# EAGLE board STGHW00054_A2 (EAGLE 9.6.2), part 1 of 2
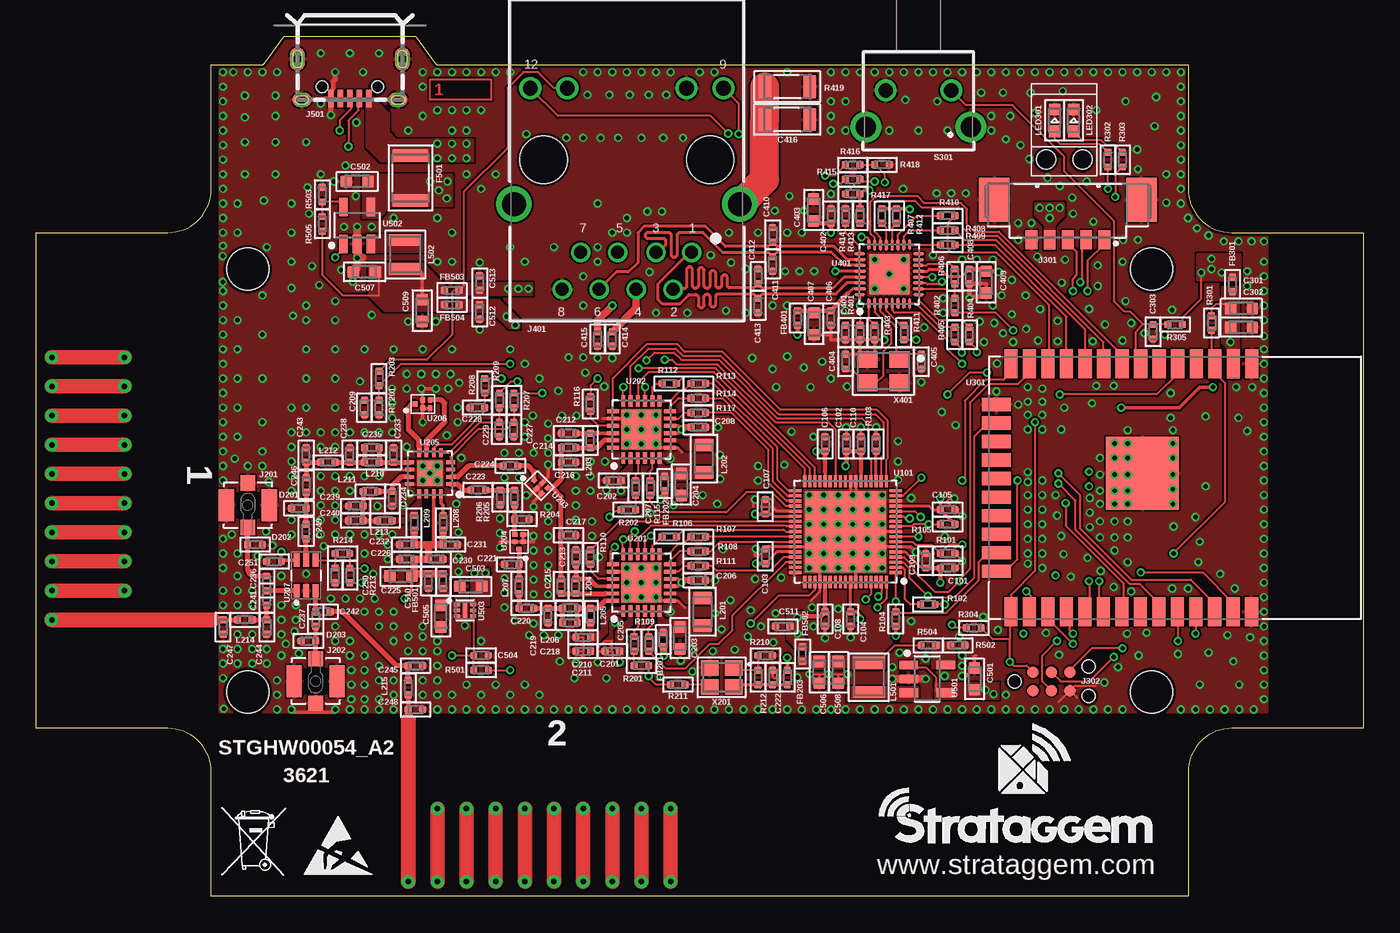
[diagram p6: board, top side]
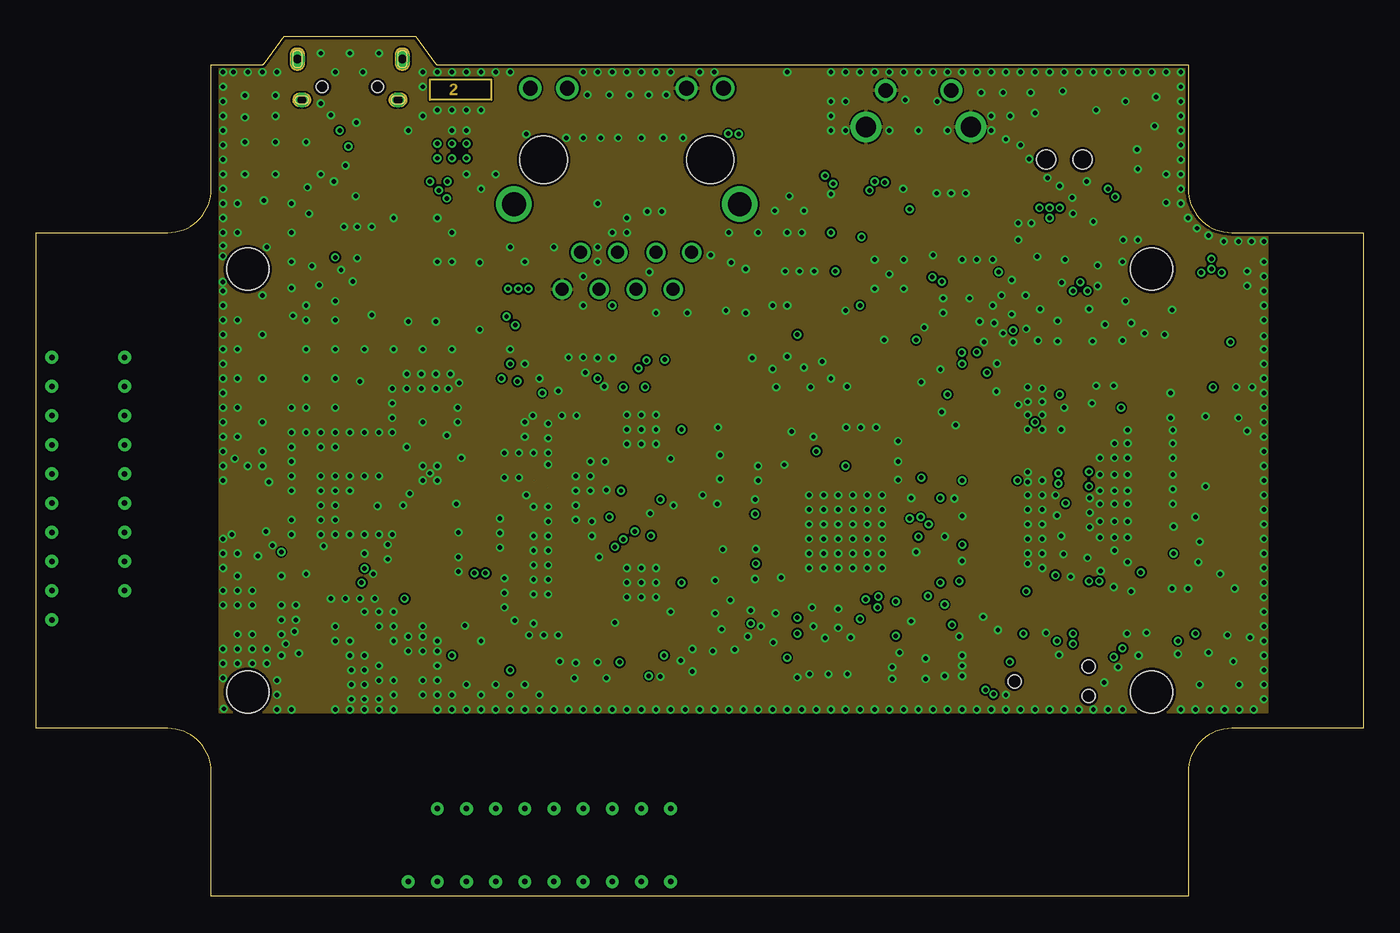
[diagram p7: board, inner layer Route2]
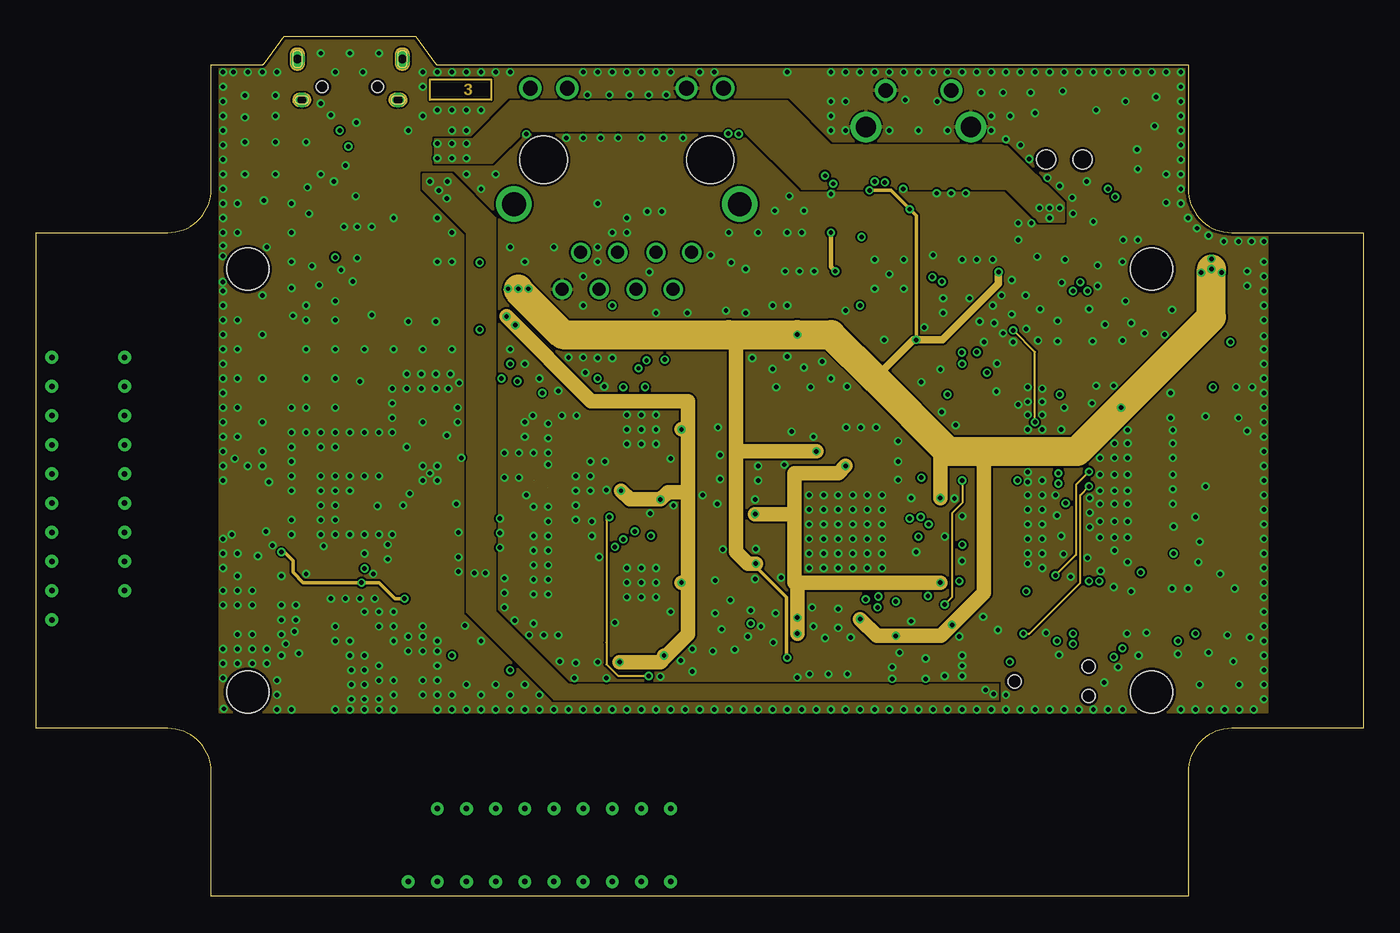
[diagram p8: board, inner layer Route15]
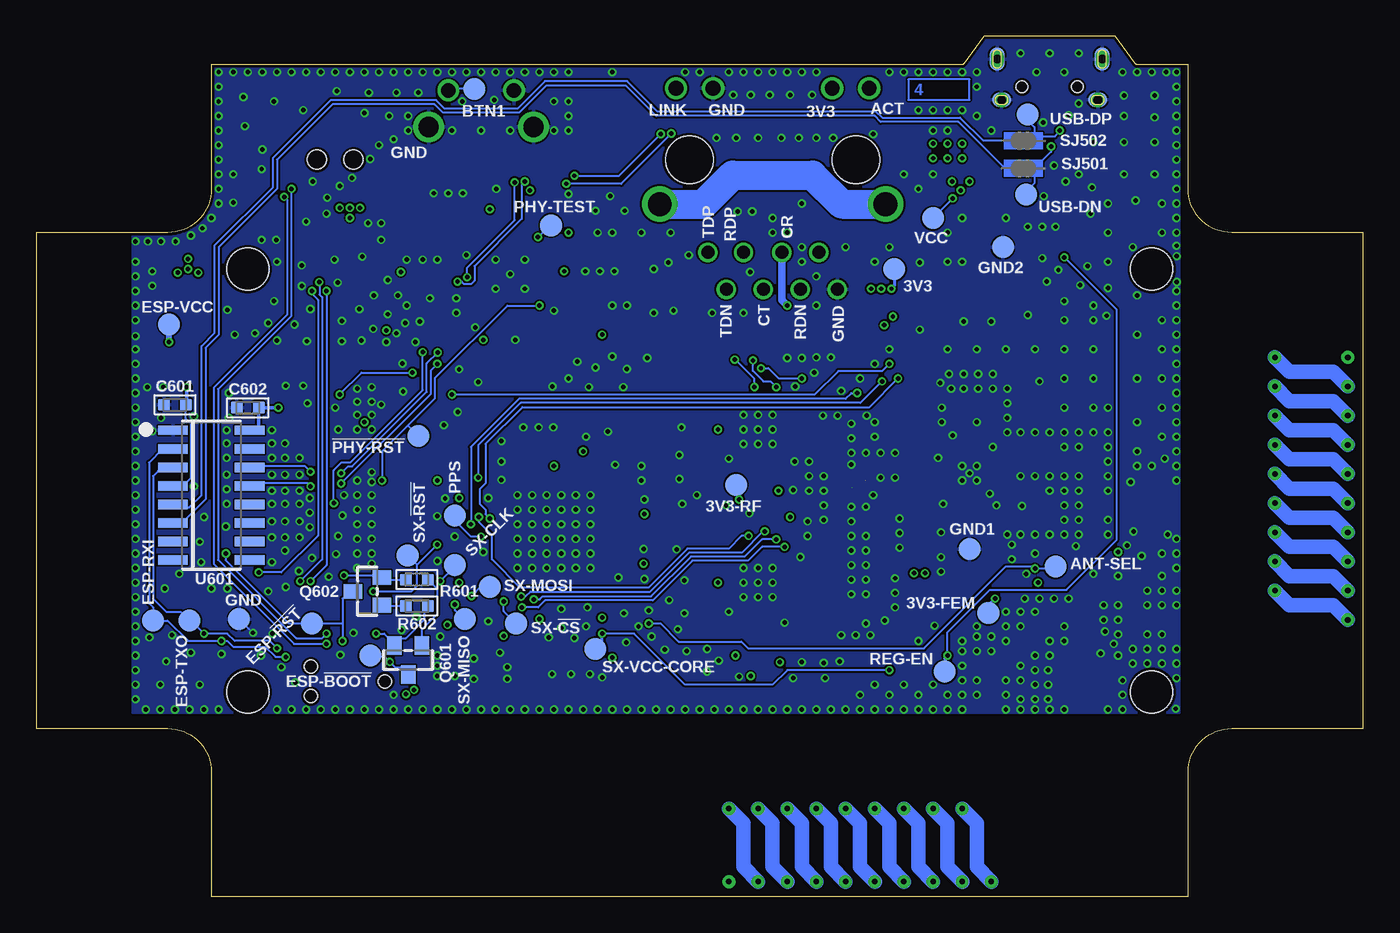
[diagram p9: board, bottom side, seen from below]

Size 91 x 58.95 mm. Coordinates in mm from the lower left corner, seen from the top.
Outline: 0,45.5 9,45.5 arc90 12,48.5 12,57 15.45,57 arc53 15.61,57.08 17,58.95 26,58.95 27.39,57.08 arc53 27.55,57 79,57 79,48.5 arc90 82,45.5 91,45.5 91,11.5 82,11.5 arc90 79,8.5 79,0 12,0 12,8.5 arc90 9,11.5 0,11.5 0,45.5
Copper layers (1+2*15+16): Top 0.035mm / dielectric 0.2mm / Route2 0.0175mm / dielectric 1.065mm / Route15 0.0175mm / dielectric 0.2mm / Bottom 0.035mm
Design rules "JLCPCB_4L *": minimum track width 5mil, minimum drill 12mil, track to track 5mil, track to pad 5mil, pad to pad 5mil, via to via 5mil, smd to smd 0mil, copper to edge 0.2mm, drill to drill 12mil, minimum pad ring 5mil, minimum via ring 5mil, stop-mask expansion 2mil, vias tented up to drill 12mil, thermal gap 5mil
Net classes: 0 default: width 0.152 mm; 1 LORA_RF: width 0.349 mm, clearance 0.203 mm to class 0, clearance 0.203 mm; 2 ETH_DP: width 0.203 mm, clearance 0.3 mm to class 0, clearance 0.203 mm; 3 CHASSIS_GND: clearance 0.5 mm to class 0, clearance 0.5 mm to class 1, clearance 0.5 mm to class 2, clearance 0.5 mm
tKeepout: area 11.8,40.2 to 17.2,45.8; area 11.8,11.2 to 17.2,16.8; area 73.8,11.2 to 79.2,16.8; area 73.8,40.2 to 79.2,45.8

## Footprints (pad centres in the part's own frame; a part is rotated, then mirrored left to right if it is on the bottom)
TESTPOINT-1.5MM = smd 1.5 x 1.5: 1 0,0
DN038 = smd 0.4 x 0.4: FEED 0,-0.2 | drill 0.38 pad 0.89: P$1 0,11.5; P$2 2,6.5; P$3 2,11.5; P$4 4,6.5; P$5 4,11.5; P$6 6,6.5; P$7 6,11.5; P$8 8,6.5; P$9 8,11.5; P$10 10,6.5; P$11 10,11.5; P$12 12,6.5; P$13 12,11.5; P$14 14,6.5; P$15 14,11.5; P$16 16,6.5; P$17 16,11.5; P$18 18,6.5; P$19 18,11.5
DN038_MIRROR = smd 0.4 x 0.4: FEED 9,-0.2 | drill 0.38 pad 0.89: P$1 9,11.5; P$2 7,6.5; P$3 7,11.5; P$4 5,6.5; P$5 5,11.5; P$6 3,6.5; P$7 3,11.5; P$8 1,6.5; P$9 1,11.5; P$10 -1,6.5; P$11 -1,11.5; P$12 -3,6.5; P$13 -3,11.5; P$14 -5,6.5; P$15 -5,11.5; P$16 -7,6.5; P$17 -7,11.5; P$18 -9,6.5; P$19 -9,11.5
C0402 = smd 0.5 x 0.5: 1 -0.5,0; 2 0.5,0
C0603 = smd 0.8 x 0.8: 1 -0.75,0; 2 0.75,0
C1206-H0.8 = smd 0.9 x 1.6: 1 -1.55,0; 2 1.55,0
TVS0402 = smd 0.5 x 0.5: 1 -0.5,0; 2 0.5,0
1210 = smd 0.9 x 2.5: 1 -1.55,0; 2 1.55,0
FB0402 = smd 0.5 x 0.5: 1 -0.5,0; 2 0.5,0
U.FL_AMPHENOL_RF_A-1JB = smd 2.2 x 1.05: 1@GND 0,-1.475; GND 0,1.475 | smd 1.05 x 1: 2@GND -1.525,0; ANT 1.525,0
533980567-PICOBLADE-5P-SMT-VER = smd 0.8 x 1.3: 1 2.5,-1.25; 2 1.25,-1.25; 3 0,-1.25; 4 -1.25,-1.25; 5 -2.5,-1.25 | smd 2.1 x 3: M1 5.05,1.5; M2 -5.05,1.5
TC2030-MCP-NL = smd 0.787 x 0.787: 1 1.27,-0.635; 2 1.27,0.635; 3 2.54,-0.635; 4 2.54,0.635; 5 3.81,-0.635; 6 3.81,0.635 | hole 0.889: 0,0; 5.08,-1.016; 5.08,1.016
RJ45_8P_TH_2LED = drill 0.89: 1 4.45,-6.35; 2 3.18,-8.89; 3 2,-6.35; 4 0.64,-8.89; 5 -0.63,-6.35; 6 -1.9,-8.89; 7 -3.17,-6.35; 8 -4.44,-8.89 | drill 1.02: 9 6.625,4.9; 10 4.085,4.9; 11 -4.085,4.9; 12 -6.625,4.9 | drill 1.63: Z1 -7.745,-3.05; Z2 7.745,-3.05 | hole 3.25: -5.715,0; 5.715,0
USB_MICRO_3 = smd 0.4 x 1.2: 1 -1.3,2.7; 2 -0.65,2.7; 3 0,2.7; 4 0.65,2.7; 5 1.3,2.7 | drill 0.6 pad 1: M1 -3.3,2.8; M2 3.3,2.8 | drill 0.6 pad 0.8 long: M3 -3.6,0; M4 3.6,0 | smd 1.3 x 1 bottom: MB1 -3.3,2.8; MB2 3.3,2.8 | smd 1 x 1.6 bottom: MB3 -3.6,0; MB4 3.6,0 | smd 1.3 x 1: MT1 -3.3,2.8; MT2 3.3,2.8 | smd 1 x 1.6: MT3 -3.6,0; MT4 3.6,0 | hole 0.8: -1.9,1.9; 1.9,1.9
L0805 = smd 0.9 x 1.3: 1 -0.95,0; 2 0.95,0
L0402 = smd 0.5 x 0.5: 1 -0.5,0; 2 0.5,0
1008 = smd 0.8 x 2.2: 1 -1,0; 2 1,0
LED0603 = smd 0.8 x 0.8: A -0.75,0; K 0.75,0
SLP3-150-250-F = hole 1.3: -1.25,0; 1.25,0
SOT23-WIDE = smd 1 x 1.27: 1 -0.95,-1; 2 0.95,-1; 3 0,1
R0402 = smd 0.5 x 0.5: 1 -0.5,0; 2 0.5,0
R1206 = smd 0.9 x 1.6: 1 -1.55,0; 2 1.55,0
R0603 = smd 0.8 x 0.8: 1 -0.75,0; 2 0.75,0
6MM-TH-RA = drill 1.4: 1 -3.6,1.25; 4 3.6,1.25 | drill 1: 2 -2.25,-1.25; 3 2.25,-1.25
JUMPER2-0603_NC = smd 0.305 x 0.152: 1 0,0.76; 2 0,-0.76
QFN35P700X700X80-69T556 = smd 0.85 x 0.22: 1 -3.45,2.8; 2 -3.451,2.45; 3 -3.451,2.1; 4 -3.451,1.75; 5 -3.451,1.4; 6 -3.451,1.05; 7 -3.451,0.7; 8 -3.451,0.35; 9 -3.451,0; 10 -3.451,-0.35; 11 -3.451,-0.7; 12 -3.451,-1.05; 13 -3.451,-1.4; 14 -3.451,-1.75; 15 -3.451,-2.1; 16 -3.451,-2.45; 17 -3.451,-2.8; 35 3.451,-2.8; 36 3.451,-2.45; 37 3.451,-2.1; 38 3.451,-1.75; 39 3.451,-1.4; 40 3.451,-1.05; 41 3.451,-0.7; 42 3.451,-0.35; 43 3.451,0; 44 3.451,0.35; 45 3.451,0.7; 46 3.451,1.05; 47 3.451,1.4; 48 3.451,1.75; 49 3.451,2.1; 50 3.451,2.45; 51 3.451,2.8 | smd 0.22 x 0.85: 18 -2.8,-3.451; 19 -2.45,-3.451; 20 -2.1,-3.451; 21 -1.75,-3.451; 22 -1.4,-3.451; 23 -1.05,-3.451; 24 -0.7,-3.451; 25 -0.35,-3.451; 26 0,-3.451; 27 0.35,-3.451; 28 0.7,-3.451; 29 1.05,-3.451; 30 1.4,-3.451; 31 1.75,-3.451; 32 2.1,-3.451; 33 2.45,-3.451; 34 2.8,-3.451; 52 2.8,3.451; 53 2.45,3.451; 54 2.1,3.451; 55 1.75,3.451; 56 1.4,3.451; 57 1.05,3.451; 58 0.7,3.451; 59 0.35,3.451; 60 0,3.451; 61 -0.35,3.451; 62 -0.7,3.451; 63 -1.05,3.451; 64 -1.4,3.451; 65 -1.75,3.451; 66 -2.1,3.451; 67 -2.45,3.451; 68 -2.8,3.451 | smd 5.56 x 5.56: 69 0,0
QFN50P400X400X100-25T270 = smd 0.811 x 0.264: 1 -1.951,1.25; 2 -1.951,0.75; 3 -1.951,0.25; 4 -1.951,-0.25; 5 -1.951,-0.75; 6 -1.951,-1.25; 13 1.951,-1.25; 14 1.951,-0.75; 15 1.951,-0.25; 16 1.951,0.25; 17 1.951,0.75; 18 1.951,1.25 | smd 0.264 x 0.811: 7 -1.25,-1.951; 8 -0.75,-1.951; 9 -0.25,-1.951; 10 0.25,-1.951; 11 0.75,-1.951; 12 1.25,-1.951; 19 1.25,1.951; 20 0.75,1.951; 21 0.25,1.951; 22 -0.25,1.951; 23 -0.75,1.951; 24 -1.25,1.951 | smd 2.7 x 2.7: 25 0,0
B4377 = smd 0.3 x 0.375: 1 -0.5,0; 2 0,-0.287; 3 0.5,-0.287; 4 0.5,0.287; 5 0,0.287
QFN50P300X300X80-17T170 = smd 0.6 x 0.25: 1 -1.401,0.75; 2 -1.401,0.25; 3 -1.401,-0.25; 4 -1.401,-0.75; 9 1.401,-0.75; 10 1.401,-0.25; 11 1.401,0.25; 12 1.401,0.75 | smd 0.25 x 0.6: 5 -0.75,-1.401; 6 -0.25,-1.401; 7 0.25,-1.401; 8 0.75,-1.401; 13 0.75,1.401; 14 0.25,1.401; 15 -0.25,1.401; 16 -0.75,1.401 | smd 1.7 x 1.7: 17 0,0
SC70-6 = smd 0.4 x 0.9: 1 -0.65,-1.05; 2 0,-1.05; 3 0.65,-1.05; 4 0.65,1.05; 5 0,1.05; 6 -0.65,1.05
ESP32-WROOM-32D = smd 2 x 0.9: 1 -8.5,5.26; 2 -8.5,3.99; 3 -8.5,2.72; 4 -8.5,1.45; 5 -8.5,0.18; 6 -8.5,-1.09; 7 -8.5,-2.36; 8 -8.5,-3.63; 9 -8.5,-4.9; 10 -8.5,-6.17; 11 -8.5,-7.44; 12 -8.5,-8.71; 13 -8.5,-9.98; 14 -8.5,-11.25; 25 8.5,-11.26; 26 8.5,-9.99; 27 8.5,-8.72; 28 8.5,-7.45; 29 8.5,-6.18; 30 8.5,-4.91; 31 8.5,-3.64; 32 8.5,-2.37; 33 8.5,-1.1; 34 8.5,0.17; 35 8.5,1.44; 36 8.5,2.71; 37 8.5,3.98; 38 8.5,5.25 | smd 0.9 x 2: 15 -5.715,-12.25; 16 -4.445,-12.25; 17 -3.175,-12.25; 18 -1.905,-12.25; 19 -0.635,-12.25; 20 0.635,-12.25; 21 1.905,-12.25; 22 3.175,-12.25; 23 4.445,-12.25; 24 5.715,-12.25 | smd 5 x 5: PAD -1,-2.24
QFN40P400X400X90-33T275N = smd 0.75 x 0.2: 1 -2.025,1.4; 8 -2.025,-1.4; 17 2.025,-1.4; 24 2.025,1.4 | smd 0.8 x 0.2: 2 -2,1; 3 -2,0.6; 4 -2,0.2; 5 -2,-0.2; 6 -2,-0.6; 7 -2,-1; 18 2,-1; 19 2,-0.6; 20 2,-0.2; 21 2,0.2; 22 2,0.6; 23 2,1 | smd 0.2 x 0.75: 9 -1.4,-2.025; 16 1.4,-2.025; 25 1.4,2.025; 32 -1.4,2.025 | smd 0.2 x 0.8: 10 -1,-2; 11 -0.6,-2; 12 -0.2,-2; 13 0.2,-2; 14 0.6,-2; 15 1,-2; 26 1,2; 27 0.6,2; 28 0.2,2; 29 -0.2,2; 30 -0.6,2; 31 -1,2 | smd 2.75 x 2.75: 33 0,0
SOT95P280X120-5 = smd 1.273 x 0.592: 1 -1.269,0.95; 2 -1.269,0; 3 -1.269,-0.95; 4 1.269,-0.95; 5 1.269,0.95
SON40P120X120X80-7T40X108N = smd 0.4 x 0.24: 1 -0.55,0.4; 2 -0.55,0; 3 -0.55,-0.4; 4 0.55,-0.4; 5 0.55,0; 6 0.55,0.4 | smd 0.3 x 1: 7 0,0
SOIC127P600X175-16 = smd 2.046 x 0.645: 1 -2.635,4.445; 2 -2.635,3.175; 3 -2.635,1.905; 4 -2.635,0.635; 5 -2.635,-0.635; 6 -2.635,-1.905; 7 -2.635,-3.175; 8 -2.635,-4.445; 9 2.635,-4.445; 10 2.635,-3.175; 11 2.635,-1.905; 12 2.635,-0.635; 13 2.635,0.635; 14 2.635,1.905; 15 2.635,3.175; 16 2.635,4.445
PFF10-4-7(OUTLINE) = hole 2.9: -31,14.5; -31,-14.5; 31,-14.5; 31,14.5
OSCCC250X200X90N = smd 1.2 x 1.05: 1 -0.825,-0.65; 2 0.825,-0.65; 3 0.825,0.65; 4 -0.825,0.65
OSCCC350X250X80 = smd 1.4 x 1.15: 1 -1.1,-0.8; 2 1.1,-0.8; 3 1.1,0.8; 4 -1.1,0.8

## Placement (x,y rotation side)
3V3  TESPOINT-SMD1.5MM  [TESTPOINT-1.5MM]  32.15,43 0 bottom
3V3-FEM  TESPOINT-SMD1.5MM  [TESTPOINT-1.5MM]  25.7,19.4 0 bottom
3V3-RF  TESPOINT-SMD1.5MM  [TESTPOINT-1.5MM]  43,28.2 0 bottom
!PHY-RST!  TESPOINT-SMD1.5MM  [TESTPOINT-1.5MM]  64.8,31.56 0 bottom
ANT201  MLA-DN038  [DN038]  12.55,18.95 90 top
ANT202  MLA-DN038-MIRROR  [DN038_MIRROR]  34.5,12.5 180 top
ANT-SEL  TESPOINT-SMD1.5MM  [TESTPOINT-1.5MM]  21.1,22.6 0 bottom
BTN1  TESPOINT-SMD1.5MM  [TESTPOINT-1.5MM]  60.95,55.35 0 bottom
C101  1uF  [C0402]  62.5,22.5 180 top
C102  1uF  [C0402]  55.55,31 270 top
C103  100nF  [C0402]  50,23.3 270 top
C104  100nF  [C0402]  55.85,19 90 top
C105  100nF  [C0402]  62.5,26.5 180 top
C106  100nF  [C0402]  54.1,31 270 top
C107  100nF  [C0402]  50,26.7 270 top
C108  100nF  [C0402]  54.1,19 90 top
C109  100nF  [C0402]  61,23 270 top
C110  100nF  [C0402]  56.55,31 270 top
C201  1uF  [C0402]  39.5,16.8 0 top
C202  1uF  [C0402]  39.6,28.5 0 top
C203  470nF  [C0603]  44.15,17.7 90 top
C204  470nF  [C0603]  44.25,28.23 90 top
C205  10pF  [C0402]  41,17.3 270 top
C206  100nF  [C0402]  45.4,21.65 180 top
C207  10pF  [C0402]  41.1,28 270 top
C208  100nF  [C0402]  45.4,32.15 180 top
C209  100nF  [C0402]  22.5,33.5 90 top
C210  47pF  [C0402]  37.5,17.75 0 top
C211  47nF  [C0402]  37.5,16.8 0 top
C212  3.6pF  [C0402]  36.5,31.75 0 top
C213  3.6pF  [C0402]  37,23.25 270 top
C214  3.6pF  [C0402]  36.5,30.75 180 top
C215  3.6pF  [C0402]  36,21.25 90 top
C216  DNP  [C0402]  36.5,29.75 180 top
C217  DNP  [C0402]  36.5,24.75 180 top
C218  3.3pF  [C0402]  36.6,18.75 0 top
C219  5.6pF  [C0402]  35.1,19.25 90 top
C220  39pF  [C0402]  33.6,19.75 0 top
C221  2.2pF  [C0402]  32.6,22.75 0 top
C222  100nF  [C0402]  50.5,15 270 top
C223  56pF  [C0402]  30.3,27.85 180 top
C224  56pF  [C0402]  32.5,29.5 180 top
C225  10uF  [C0603]  25,21.95 0 top
C226  10nF  [C0402]  25.4,23.1 180 top
C227  56pF  [C0402]  32.75,32 90 top
C228  56pF  [C0402]  30.25,33.5 0 top
C229  56pF  [C0402]  31.75,32 90 top
C230  1nF  [C0402]  27.4,23.1 180 top
C231  100pF  [C0402]  28.4,24.1 0 top
C232  100pF  [C0402]  25.4,24.1 180 top
C233  3.3pF  [C0402]  24.5,30.25 90 top
C234  1.3pF  [C0402]  24.4,27.25 270 top
C235  1.5pF  [C0402]  23,30.75 180 top
C236  56pF  [C0402]  15.8,21.45 90 top
C237  56pF  [C0402]  19.15,19 270 top
C238  3.3pF  [C0402]  21.5,30.25 90 top
C239  10pF  [C0402]  21.9,26.75 180 top
C240  DNP  [C0402]  21.9,25.75 180 top
C241  56pF  [C0402]  15.8,20.45 90 top
C242  56pF  [C0402]  19.65,19.5 180 top
C243  2.7pF  [C0402]  18.5,30.25 90 top
C244  6.2pF  [C0402]  15.8,18.45 270 top
C245  DNP  [C0402]  26,15.8 0 top
C246  56pF  [C0402]  18.5,28.2 270 top
C247  DNP  [C0402]  12.8,18.45 270 top
C248  4.1nH  [C0402]  26,12.8 0 top
C249  56pF  [C0402]  18.5,25 90 top
C250  56pF  [C0402]  20.5,22 90 top
C251  100nF  [C0402]  16.3,22.95 0 top
C301  10uF  [C0603]  82.65,40.3 180 top
C302  10uF  [C0603]  82.65,39 180 top
C303  100nF  [C0402]  76.6,38.7 90 top
C401  100nF  [C0402]  55.5,38.65 90 top
C402  100nF  [C0402]  54.5,46.65 270 top
C403  10uF  [C0603]  53.3,47.05 270 top
C404  10pF  [C0402]  55.5,36.65 270 top
C405  10pF  [C0402]  60.7,36.65 90 top
C406  100nF  [C0402]  54.5,39.65 90 top
C407  10uF  [C0603]  53.35,39.25 90 top
C408  100nF  [C0402]  64,42.5 90 top
C409  10uF  [C0603]  65.15,42.1 90 top
C410  10pF  [C0402]  50.5,45.35 270 top
C411  10pF  [C0402]  50.5,43.35 90 top
C412  10pF  [C0402]  49.5,42.5 270 top
C413  10pF  [C0402]  49.5,40.5 90 top
C414  100nF  [C0402]  39.5,38.2 90 top
C415  100nF  [C0402]  38.5,38.2 90 top
C416  1nF 1kV  [C1206-H0.8]  51.5,53.25 180 top
C501  10uF  [C0603]  64.34,14.9 270 top
C502  10uF  [C0603]  22,49 180 top
C503  10uF  [C0603]  29.8,21.25 0 top
C504  100nF  [C0402]  30.5,16.5 180 top
C505  10uF  [C0603]  27.75,19.2 90 top
C506  10uF  [C0603]  53.7,15.35 90 top
C507  10uF  [C0603]  22.5,42.8 180 top
C508  10uF  [C0603]  55,15.35 270 top
C509  10uF  [C0603]  26.45,40.15 270 top
C510  100nF  [C0402]  26.9,21.6 90 top
C511  100nF  [C0402]  51.2,18.5 0 top
C512  100nF  [C0402]  30.4,40.05 90 top
C513  100nF  [C0402]  30.4,42.05 270 top
C601  1uF  [C0603]  81.5,33.7 0 bottom
C602  100nF  [C0603]  76.5,33.5 0 bottom
D201  8231714A  [TVS0402]  18,26.6 0 top
D202  8231714A  [TVS0402]  15,24.1 180 top
D203  8231714A  [TVS0402]  18.65,17.5 0 top
ESP-!BOOT!  TESPOINT-SMD1.5MM  [TESTPOINT-1.5MM]  68.1,16.5 0 bottom
ESP-!RST!  TESPOINT-SMD1.5MM  [TESTPOINT-1.5MM]  72.1,18.7 0 bottom
ESP-RXI  TESPOINT-SMD1.5MM  [TESTPOINT-1.5MM]  83,18.9 0 bottom
ESP-TXO  TESPOINT-SMD1.5MM  [TESTPOINT-1.5MM]  80.5,18.9 0 bottom
ESP-VCC  TESPOINT-SMD1.5MM  [TESTPOINT-1.5MM]  81.9,39.2 0 bottom
F501  1.5/3A 8V  [1210]  25.65,49.25 270 top
FB201  DNP  [FB0402]  43,17.6 90 top
FB202  DNP  [FB0402]  43.1,28.3 90 top
FB203  >1A 60R@100MHz DCR<0.1R  [FB0402]  51.5,15 270 top
FB301  >1A 60R@100MHz DCR<0.1R  [FB0402]  82.05,41.95 90 top
FB401  >1A 60R@100MHz DCR<0.1R  [FB0402]  52.2,39.65 270 top
FB501  >1A 60R@100MHz DCR<0.1R  [FB0402]  27.9,21.6 90 top
FB502  >1A 60R@100MHz DCR<0.1R  [FB0402]  52.55,16.6 90 top
FB503  >1A 60R@100MHz DCR<0.1R  [FB0402]  28.5,41.55 0 top
FB504  >1A 60R@100MHz DCR<0.1R  [FB0402]  28.5,40.55 0 top
GND  TESPOINT-SMD1.5MM  [TESTPOINT-1.5MM]  77.1,19 0 bottom
GND1  TESPOINT-SMD1.5MM  [TESTPOINT-1.5MM]  27,23.8 0 bottom
GND2  TESPOINT-SMD1.5MM  [TESTPOINT-1.5MM]  24.7,44.5 0 bottom
J201  DNP  [U.FL_AMPHENOL_RF_A-1JB]  14.5,26.8 270 top
J202  DNP  [U.FL_AMPHENOL_RF_A-1JB]  19.15,14.75 90 top
J301  DNP  [533980567-PICOBLADE-5P-SMT-VER]  70.75,46.25 0 top
J302  TC2030-ESP-NL  [TC2030-MCP-NL]  67.09,14.73 0 top
J401  HR913550A  [RJ45_8P_TH_2LED]  40.5,50.5 0 top
J501  U254-051N-4BH806  [USB_MICRO_3]  21.5,57.4 180 top
L201  15uH >100mA <2R  [L0805]  45.7,19.5 90 top
L202  15uH >100mA <2R  [L0805]  45.8,30 90 top
L203  12nH  [L0402]  38,31.25 90 top
L204  12nH  [L0402]  37,21.25 90 top
L205  47nH  [L0402]  38,19.25 270 top
L206  2.5nH  [L0402]  36.6,19.75 180 top
L207  4.7nH  [L0402]  33.1,21.25 90 top
L208  1.2nH  [L0402]  27.9,25.6 270 top
L209  6.8nH  [L0402]  25.9,25.6 270 top
L210  5.6nH  [L0402]  23,29.75 180 top
L211  7.5nH  [L0402]  22.9,27.75 180 top
L212  5.6nH  [L0402]  20,29.75 180 top
L213  3.0nH  [L0402]  23.9,25.75 0 top
L214  6.2nH  [L0402]  14.3,18.95 180 top
L215  4.0pF  [L0402]  25.5,14.3 270 top
L501  2.2uH  [1008]  57.1,15 90 top
L502  2.2uH  [1008]  25.3,44 270 top
LED301  GREEN  [LED0603]  69.85,53.2 90 top
LED302  RED  [LED0603]  71.15,53.2 90 top
LOGO1  LOGO_STRATAGGEM_SILK_5  [STG_LOGO_1L_SILK_5]  66,7 0 top
LOGO601  ESD_LOGO-SILK-TOP-5  [ESD_TOP_5MM]  20.7,3.5 0 top
LOGO602  DEEE_LOGO-SILK-TOP-5  [DEEE_MUELLTONNE_TOP_5MM]  14.9,3.8 0 top
LP1  SLP3-150-250-F  [SLP3-150-250-F]  70.5,50.5 180 top
PHY-TEST  TESPOINT-SMD1.5MM  [TESTPOINT-1.5MM]  55.7,46 0 bottom
PPS  TESPOINT-SMD1.5MM  [TESTPOINT-1.5MM]  62.3,26.1 0 bottom
Q601  MMBT2222A  [SOT23-WIDE]  65.5,16.2 180 bottom
Q602  MMBT2222A  [SOT23-WIDE]  68.3,20.9 90 bottom
R101  10K  [R0402]  62.5,23.5 180 top
R102  100R  [R0402]  61.15,20 180 top
R103  0R  [R0402]  57.6,31 90 top
R104  10K  [R0402]  58.95,19 90 top
R105  10K  [R0402]  62.5,25.5 180 top
R106  0R  [R0402]  43.4,24.65 0 top
R107  0R  [R0402]  45.4,24.65 0 top
R108  0R  [R0402]  45.4,23.65 0 top
R109  0R  [R0402]  42,17.3 270 top
R110  0R  [R0402]  38,23.25 90 top
R111  0R  [R0402]  45.4,22.65 0 top
R112  0R  [R0402]  43.4,35.15 0 top
R113  0R  [R0402]  45.4,35.15 0 top
R114  0R  [R0402]  45.4,34.15 0 top
R115  0R  [R0402]  42.1,28 270 top
R116  0R  [R0402]  38,33.75 90 top
R117  0R  [R0402]  45.4,33.15 0 top
R201  220R  [R0402]  41.5,15.8 180 top
R202  220R  [R0402]  40.6,26.5 0 top
R203  33K  [R0402]  23.5,35.5 270 top
R204  DNP  [R0402]  33.3,25.85 0 top
R205  56pF  [R0402]  32.8,27.35 90 top
R206  DNP  [R0402]  31.8,27.35 270 top
R207  100R  [R0402]  32.75,34 270 top
R208  100R  [R0402]  30.75,35 270 top
R209  100R  [R0402]  31.75,34 270 top
R210  0R  [R0402]  50,16.5 0 top
R211  0R  [R0402]  44,14.5 180 top
R212  DNP  [R0402]  49.5,15 270 top
R213  10K  [R0402]  21.5,22 270 top
R214  100R  [R0402]  21,23.5 180 top
R301  10K  [R0402]  80.6,39.3 270 top
R302  1K  [R0402]  73.5,50.5 90 top
R303  1K  [R0402]  74.5,50.5 90 top
R304  20K  [R0402]  64.3,18.4 0 top
R305  100K  [R0402]  78.1,39.2 0 top
R401  10K  [R0402]  56.5,38.65 90 top
R402  10R  [R0402]  63,40.5 90 top
R403  5.1K  [R0402]  57.5,38.65 90 top
R404  10R  [R0402]  64,38.5 90 top
R405  10R  [R0402]  63,38.5 90 top
R406  0R  [R0402]  63,42.5 90 top
R407  5.1K  [R0402]  58,46.65 90 top
R408  10R  [R0402]  62.5,45.65 180 top
R409  10R  [R0402]  62.5,44.65 180 top
R410  10R  [R0402]  62.5,46.65 180 top
R411  5.1K  [R0402]  59.5,38.65 270 top
R412  5.1K  [R0402]  59,46.65 90 top
R413  10K  [R0402]  56.5,46.65 90 top
R414  6.19K 1%  [R0402]  55.5,46.65 270 top
R415  330R  [R0402]  56,49.15 0 top
R416  330R  [R0402]  56,50.15 0 top
R417  5.1K  [R0402]  56,48.15 180 top
R418  5.1K  [R0402]  58,50.15 180 top
R419  DNP  [R1206]  51.5,55.5 180 top
R501  1K  [R0402]  30.5,15.5 180 top
R502  120K 1%  [R0402]  63.19,17.2 180 top
R503  150K 1%  [R0402]  19.6,48.1 270 top
R504  120K 1%  [R0402]  61.19,17.2 180 top
R505  680K 1%  [R0402]  19.6,46.1 270 top
R601  1K  [R0603]  64.9,21.7 180 bottom
R602  1K  [R0603]  64.9,19.9 0 bottom
REG-EN  TESPOINT-SMD1.5MM  [TESTPOINT-1.5MM]  28.7,15.4 0 bottom
RT201  NTC 10K 1%  [R0402]  23.5,33.5 90 top
S301  K2-1102AQ-K4CW-01  [6MM-TH-RA]  60.5,54 180 top
SJ501  JUMPER2-NC-0603  [JUMPER2-0603_NC]  23.3,49.9 270 bottom
SJ502  JUMPER2-NC-0603  [JUMPER2-0603_NC]  23.3,51.8 270 bottom
SPEC1  LAYER_4  [4LAYER]  27,54.6 0 top
SX-!CS!  TESPOINT-SMD1.5MM  [TESTPOINT-1.5MM]  58.1,18.7 0 bottom
SX-!RST!  TESPOINT-SMD1.5MM  [TESTPOINT-1.5MM]  65.54,23.37 0 bottom
SX-CLK  TESPOINT-SMD1.5MM  [TESTPOINT-1.5MM]  62.3,22.7 0 bottom
SX-MISO  TESPOINT-SMD1.5MM  [TESTPOINT-1.5MM]  61.6,19 0 bottom
SX-MOSI  TESPOINT-SMD1.5MM  [TESTPOINT-1.5MM]  59.9,21.2 0 bottom
SX-VCC-CORE  TESPOINT-SMD1.5MM  [TESTPOINT-1.5MM]  52.65,16.95 0 bottom
TM1  TM_STRATAGGEM_SILK_20  [STG_MARK_SILK_TOP_20MM]  57.8,3.6 0 top
U101  SX1302IMLTRT  [QFN35P700X700X80-69T556]  55.5,25 180 top
U201  SX1250  [QFN50P400X400X100-25T270]  41.5,21.5 90 top
U202  SX1250  [QFN50P400X400X100-25T270]  41.5,32 90 top
U203  B4377  [B4377]  34.5,28.15 315 top
U204  B4377  [B4377]  33.1,24.3 90 top
U205  SKY66420-11  [QFN50P300X300X80-17T170]  27,29 180 top
U206  B4377  [B4377]  26.5,33.75 0 top
U207  PE4259  [SC70-6]  18.5,22 0 top
U301  ESP32-WROOM-32E(M113EH3200PH3Q0)  [ESP32-WROOM-32D]  78.1,28 270 top
U401  IP101G  [QFN40P400X400X90-33T275N]  58.5,42.65 90 top
U501  BL8028CB5TR  [SOT95P280X120-5]  61.1,14.9 0 top
U502  BL8028CB5TR  [SOT95P280X120-5]  22,46 90 top
U503  NCP176BMX330TCG  [SON40P120X120X80-7T40X108N]  29.4,19.6 0 top
U601  CH340C-SOIC  [SOIC127P600X175-16]  79,27.5 0 bottom
U$1  [PFF10-4-7(OUTLINE)]  45.5,28.5 0 top
USB-DN  TESPOINT-SMD1.5MM  [TESTPOINT-1.5MM]  23.1,48.1 0 bottom
USB-DP  TESPOINT-SMD1.5MM  [TESTPOINT-1.5MM]  23,53.6 0 bottom
VCC  TESPOINT-SMD1.5MM  [TESTPOINT-1.5MM]  29.5,46.5 0 bottom
X201  32MHz <2.5ppm  [OSCCC250X200X90N]  47,15 180 top
X401  25MHz  [OSCCC350X250X80]  58.1,36 180 top